# Altium schematic sheet Sheet2.SchDoc
size A3; SheetNumber: 1; SheetTotal: 1
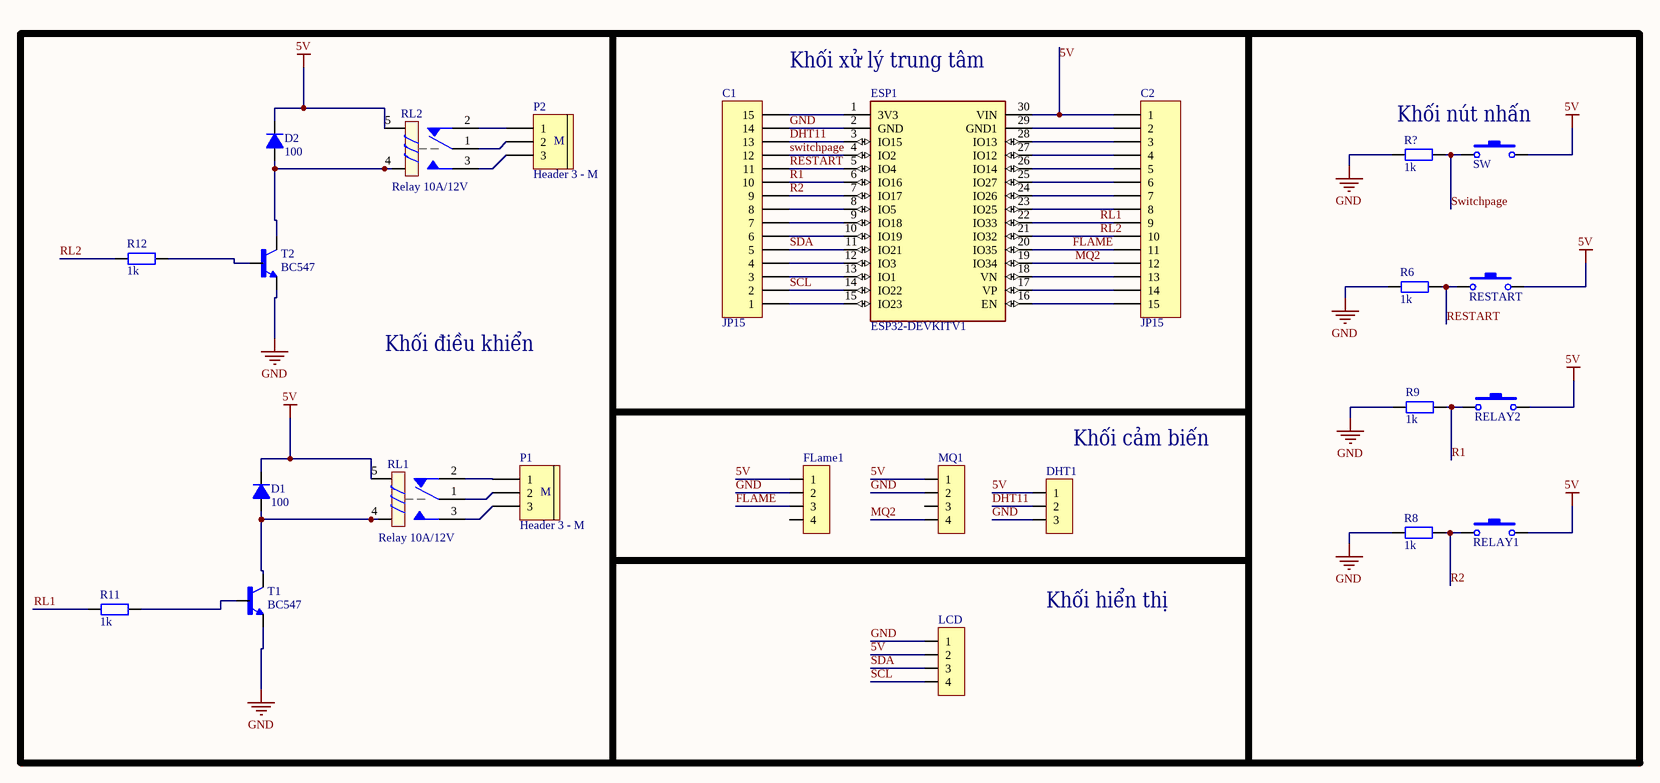
[diagram p0: Sheet2.SchDoc]

## Parts
C1  JP15  [JP15-C1T]
C2  JP15  [JP15-C1T]
D1  100  [DIODE 1A]
D2  100  [DIODE 1A]
DHT1  JP 1x3 2.54  [JP 1x3 CT]  (value not drawn)
ESP1  ESP32DEVKITV1  [ESP32-DEVKITV1_3D]  (value not drawn)
FLame1  JP 1x4 2.54  [JP 1x4 CT]  (value not drawn)
LCD  JP 1x4 2.54  [JP 1x4 CT]  (value not drawn)
MQ1  JP 1x4 2.54  [JP 1x4 CT]  (value not drawn)
P1  Header 3 - M  [Medium - Header 3]
P2  Header 3 - M  [Medium - Header 3]
R6  1k  [RES-1/4W]
R8  1k  [RES-1/4W]
R9  1k  [RES-1/4W]
R11  1k  [RES-1/4W]
R12  1k  [RES-1/4W]
R?  1k  [RES-1/4W]
RELAY1  SW  [BUTTON  ROUND]  (value not drawn)
RELAY2  SW  [BUTTON  ROUND]  (value not drawn)
RESTART  SW  [BUTTON  ROUND]  (value not drawn)
RL1  Relay 10A/12V  [RL_SPDT_10A]
RL2  Relay 10A/12V  [RL_SPDT_10A]
SW  SW  [BUTTON  ROUND]  (value not drawn)
T1  BC547  [TO92]
T2  BC547  [TO92]

## Nets
5V: C2.1 D1.2(K) D2.2(K) DHT1.1 ESP1.30(VIN) FLame1.1 LCD.2 MQ1.1 RELAY1.2 RELAY2.2 RESTART.2 RL1.5 RL2.5 SW.2
GND: C1.14 DHT1.3 ESP1.2(GND) FLame1.2 LCD.1 MQ1.2 R6.1 R8.1 R9.1 R?.1 T1.1(E) T2.1(E)
DHT11: C1.13 DHT1.2 ESP1.3(IO15)
FLAME: C2.11 ESP1.20(IO35) FLame1.3
MQ2: C2.12 ESP1.19(IO34) MQ1.4
R1: C1.10 ESP1.6(IO16) R9.2 RELAY2.1
R2: C1.9 ESP1.7(IO17) R8.2 RELAY1.1
RESTART: C1.11 ESP1.5(IO4) R6.2 RESTART.1
RL1: C2.9 ESP1.22(IO33) R11.1
RL2: C2.10 ESP1.21(IO32) R12.1
SCL: C1.2 ESP1.14(IO22) LCD.4
SDA: C1.5 ESP1.11(IO21) LCD.3
Switchpage: C1.12 ESP1.4(IO2) R?.2 SW.1
NetC1_1: C1.1 ESP1.15(IO23)
NetC1_3: C1.3 ESP1.13(IO1)
NetC1_4: C1.4 ESP1.12(IO3)
NetC1_6: C1.6 ESP1.10(IO19)
NetC1_7: C1.7 ESP1.9(IO18)
NetC1_8: C1.8 ESP1.8(IO5)
NetC1_15: C1.15 ESP1.1(3V3)
NetC2_2: C2.2 ESP1.29(GND1)
NetC2_3: C2.3 ESP1.28(IO13)
NetC2_4: C2.4 ESP1.27(IO12)
NetC2_5: C2.5 ESP1.26(IO14)
NetC2_6: C2.6 ESP1.25(IO27)
NetC2_7: C2.7 ESP1.24(IO26)
NetC2_8: C2.8 ESP1.23(IO25)
NetC2_13: C2.13 ESP1.18(VN)
NetC2_14: C2.14 ESP1.17(VP)
NetC2_15: C2.15 ESP1.16(EN)
NetD1_1: D1.1(A) RL1.4 T1.3(C)
NetD2_1: D2.1(A) RL2.4 T2.3(C)
NetP1_1: P1.1 RL1.2
NetP1_2: P1.2 RL1.1
NetP1_3: P1.3 RL1.3
NetP2_1: P2.1 RL2.2
NetP2_2: P2.2 RL2.1
NetP2_3: P2.3 RL2.3
NetR11_2: R11.2 T1.2(B)
NetR12_2: R12.2 T2.2(B)

Not connected (* = marked no-connect by the designer): FLame1 4; MQ1 3

## Notes on the sheet
- Khối xử lý trung tâm
- Khối nút nhấn
- Khối điều khiển
- (near DHT1) Khối cảm biến
- Khối hiển thị
- (in symbol ESP32DEVKITV1) ESP32-DEVKITV1
- (in symbol Header 3 - M) M

## Library data of the parts
C1 C2 = JP15: WR-PHD 2.54 mm Angled Socket Header; Manufacturer: W¨¹rth Elektronik eiSos GmbH; partNo: 613015143121; ComponentLink1 Description: Manufacturer; ComponentLink2 Description: Datasheet; NoPins: 15; Created Date: 29 March 2013; ComponentLink1URL: http://www.we-online.com; ComponentLink2URL: http://katalog.we-online.de/em/datasheet/6130xx143121.pdf; Created by: Karrer Zheng
D1 D2 = Diode 1N4007: Diode 1N4007 cắm; Ten_Linh_Kien: Diode 1N4007 1A (DIP); Don_Vi: Con; Ma_Hang: MH001063; Ghi Chu: *; Kieu_Chan: *; Chung_Loai: Cắm
DHT1 = JP 1x3 2.54 Cai Thang: Cắm; Ten_Linh_Kien: Jump Đơn Cái 2.54MM 1x20P Thẳng; Don_Vi: Con; Ma_Hang: MH004006; Ghi_Chu: *; Kieu_Chan: *; Chung_Loai: Cắm
ESP1 = ESP32DEVKITV1: Dual core, Wi-Fi: 2.4 GHz up to 150 Mbits/s,BLE (Bluetooth Low Energy) and legacy Bluetooth, 32 bits, Up to 240 MHz; MF: Do it; Check_prices: https://www.snapeda.com/parts/ESP32%20DEVKIT%20V1/Do%20it/view-part/5659245/?ref=eda; Value: *; SnapEDA_Link: https://www.snapeda.com/parts/ESP32%20DEVKIT%20V1/Do%20it/view-part/5659245/?ref=snap; Package: Package; Availability: Unavailable; Price: None; MP: ESP32 DEVKIT V1
FLame1 LCD MQ1 = JP 1x4 2.54 Cai Thang: Cắm; Ten_Linh_Kien: Jump Đơn Cái 2.54MM 1x20P Thẳng; Don_Vi: Con; Ma_Hang: MH004006; Ghi_Chu: *; Kieu_Chan: *; Chung_Loai: Cắm
P1 P2 = Header 3 - M: Header, 3-Pin, Medium; LatestRevisionDate: 17-Jul-2002; LatestRevisionNote: Re-released for DXP Platform.; Publisher: Altium Limited
R6 R8 R9 R11 R12 R? = R: Resistor R1/4W
RELAY1 RELAY2 RESTART SW = SW-Button: Switch-Button; Published: 24-Mar-1999; LatestRevisionDate: 17-Jul-2002; LatestRevisionNote: Re-released for DXP Platform.; PackageReference: SPST-2; Publisher: Altium Limited
RL1 RL2 = Relay 1: Relay SPDT,10A - 12VDC 5 Pin; Value: Relay SPDT, 10A, 12V
T1 T2 = BC547: Bipolar (BJT) Transistor NPN 45V 100mA 300MHz 625mW Through Hole TO-92 (TO-226); MF: ON; Package: E-PKG AXIAL-LEADED-2 ON Semiconductor; MP: BC547; SnapEDA_Link: https://www.snapeda.com/parts/BC547/Onsemi/view-part/?ref=snap; Value: *; Availability: In Stock; Price: None; Check_prices: https://www.snapeda.com/parts/BC547/Onsemi/view-part/?ref=eda; Purchase-URL: https://pricing.snapeda.com/search/part/BC547/?ref=eda